# EAGLE schematic untitled (EAGLE 9.2.0)
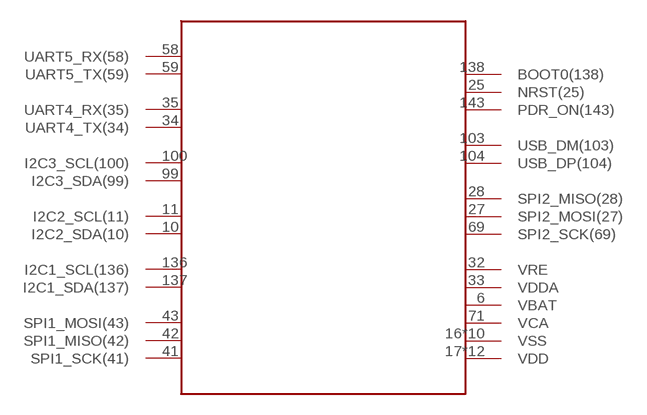
[diagram p0: schematic, sheet 1]

## Parts
U$3  STM32F446ZET6  [STM32F446ZET6]
Unconnected: U$3.6(VBAT) U$3.10(I2C2_SDA(10)) U$3.11(I2C2_SCL(11)) U$3.16(VSS) U$3.17(VDD) U$3.25(NRST(25)) U$3.27(SPI2_MOSI(27)) U$3.28(SPI2_MISO(28)) U$3.30(VDD) U$3.31(VSS) U$3.32(VRE) U$3.33(VDDA) U$3.34(UART4_TX(34)) U$3.35(UART4_RX(35)) U$3.38(VSS) U$3.39(VDD) U$3.41(SPI1_SCK(41)) U$3.42(SPI1_MISO(42)) U$3.43(SPI1_MOSI(43)) U$3.51(VSS) U$3.52(VDD) U$3.58(UART5_RX(58)) U$3.59(UART5_TX(59)) U$3.61(VSS) U$3.62(VDD) U$3.69(SPI2_SCK(69)) U$3.71(VCA) U$3.72(VDD) U$3.83(VSS) U$3.84(VDD) U$3.94(VSS) U$3.95(VDD) U$3.99(I2C3_SDA(99)) U$3.100(I2C3_SCL(100)) U$3.103(USB_DM(103)) U$3.104(USB_DP(104)) U$3.107(VSS) U$3.108(VDD) U$3.120(VSS) U$3.121(VDD) U$3.130(VSS) U$3.131(VDD) U$3.136(I2C1_SCL(136)) U$3.137(I2C1_SDA(137)) U$3.138(BOOT0(138)) U$3.143(PDR_ON(143)) U$3.144(VDD)

## Library data of the parts
U$3 = QFP50P2200X2200X160-144N:STM32F446ZET6